# Altium schematic sheet AMS_Master.SchDoc
size A4; DocumentNumber: 0; SheetNumber: 1; SheetTotal: 10
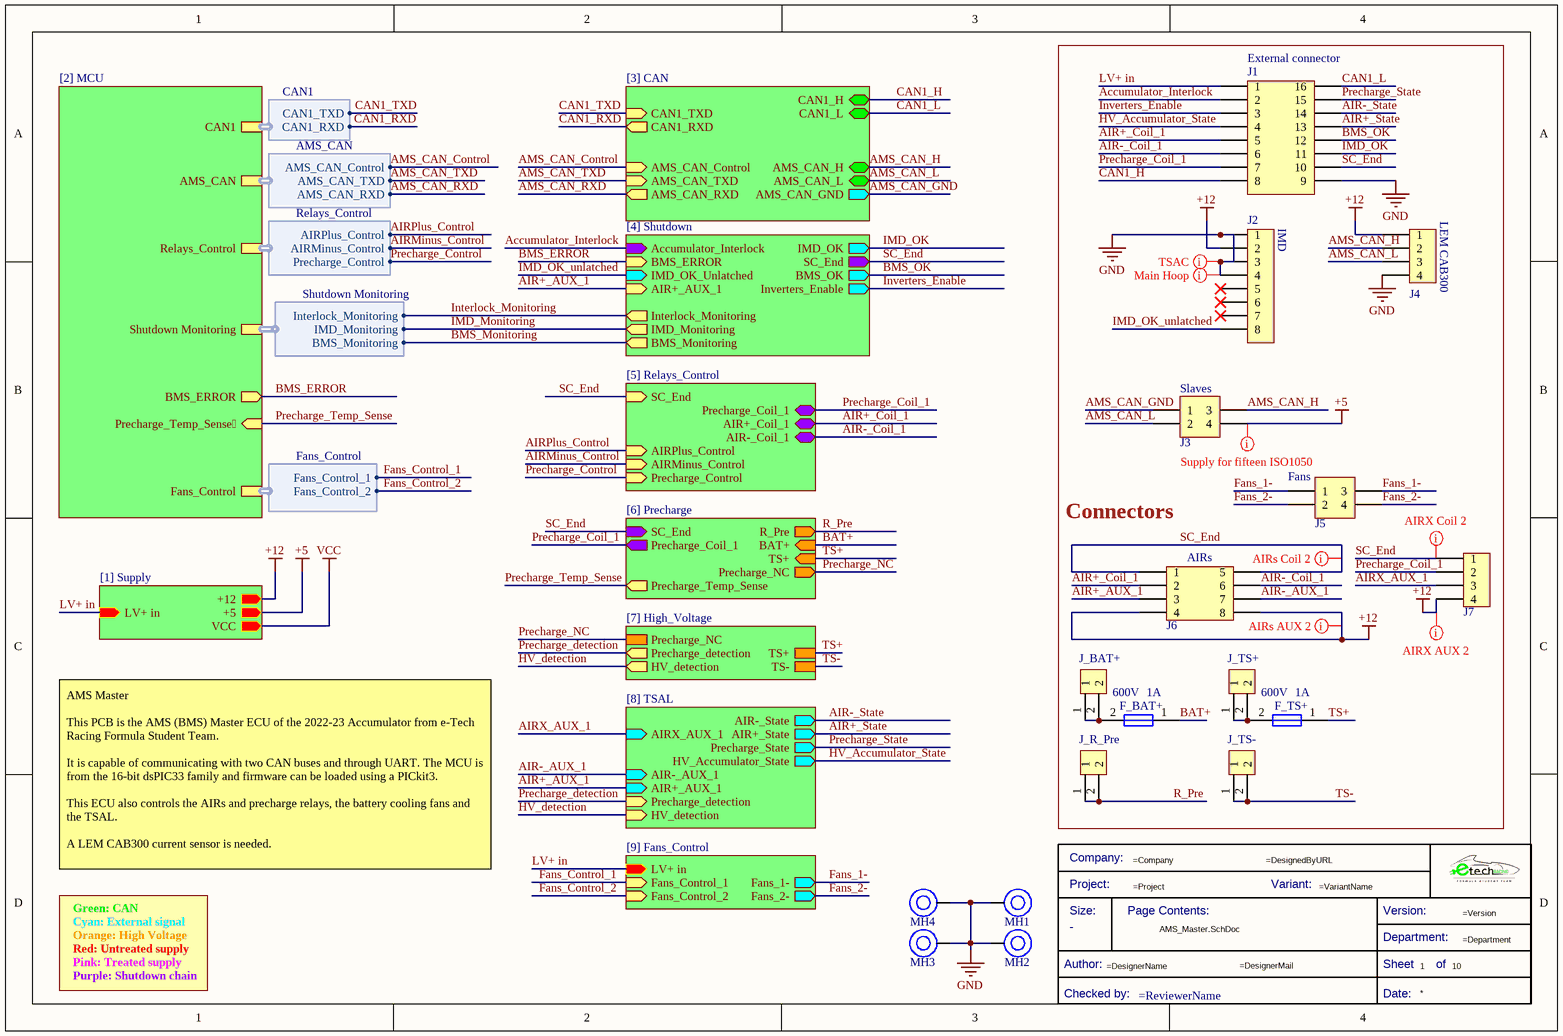
[diagram p0: AMS_Master.SchDoc]

## Parts
*?  Title Block_template  (value not drawn)  (graphical)
F_BAT+  Voltage Rating (DC): 600V  Current Rating: 1A  [Fuse_485001]  (hidden comment: 485001)
F_TS+  Voltage Rating (DC): 600V  Current Rating: 1A  [Fuse_485001]  (hidden comment: 485001)
J1  1053101116  [J_NanoFit_2x8_V]  (value not drawn)
J2  J_MicroFit_1x8_V  [J_MicroFit_1x8_V]  (value not drawn)
J3  430450412  [J_MicroFit_2x2_v]  (value not drawn)
J4  1053092104  [J_NanoFit_1x4_V]  (value not drawn)
J5  J_NanoFit_2x2  [J_NanoFit_2x2_v]  (value not drawn)
J6  0430450800  [J_MicroFit_2x4]  (value not drawn)
J7  436500400  [J_MicroFit_1x4]  (value not drawn)
J_BAT+  436500215  [J_MicroFit_2x1]  (value not drawn)
J_R_Pre  436500215  [J_MicroFit_2x1]  (value not drawn)
J_TS+  436500215  [J_MicroFit_2x1]  (value not drawn)
J_TS-  436500215  [J_MicroFit_2x1]  (value not drawn)
MH1  Mounting_Hole_M4  [Mounting_Hole_M4]  (value not drawn)
MH2  Mounting_Hole_M4  [Mounting_Hole_M4]  (value not drawn)
MH3  Mounting_Hole_M4  [Mounting_Hole_M4]  (value not drawn)
MH4  Mounting_Hole_M4  [Mounting_Hole_M4]  (value not drawn)

## Blocks framed on the sheet
Connectors: F_BAT+ F_TS+ J1-J7 J_BAT+ J_R_Pre J_TS+ J_TS-

## Sub-sheets
CAN = [3] CAN: CAN1_TXD (in), CAN1_RXD (out), AMS_CAN_TXD (in), AMS_CAN_Control (in), AMS_CAN_RXD (out), CAN1_H (bidir), CAN1_L (bidir), AMS_CAN_H (bidir), AMS_CAN_L (bidir), AMS_CAN_GND (out)
Fans_Control = [9] Fans_Control: Fans_Control_1 (in), Fans_Control_2 (in), Fans_1- (out), Fans_2- (out), LV+ in (in)
High_Voltage = [7] High_Voltage: HV_detection (out), Precharge_detection (out), TS-, TS+, Precharge_NC
MCU = [2] MCU: AMS_CAN (harness AMS_CAN), Relays_Control (harness Relays_Control), CAN1 (harness CAN1), BMS_ERROR (out), Fans_Control (harness Fans_Control), Precharge_Temp_Sense (in), Shutdown Monitoring (harness Shutdown Monitoring)
Precharge = [6] Precharge: Precharge_Temp_Sense (out), BAT+ (in), Precharge_NC (out), TS+ (in), SC_End (in), R_Pre (out), Precharge_Coil_1 (out)
Relays_Control = [5] Relays_Control: Precharge_Coil_1 (bidir), AIR+_Coil_1 (bidir), AIR-_Coil_1 (bidir), AIRPlus_Control (in), AIRMinus_Control (in), Precharge_Control (in), SC_End (in)
Shutdown = [4] Shutdown: BMS_ERROR (in), Accumulator_Interlock (in), SC_End (out), Inverters_Enable (out), BMS_OK (out), IMD_OK (out), IMD_OK_Unlatched (in), AIR+_AUX_1 (in), Interlock_Monitoring (out), BMS_Monitoring (out), IMD_Monitoring (out)
Supply = [1] Supply: +5 (out), +12 (out), VCC (out), LV+ in (in)
TSAL = [8] TSAL: Precharge_State (out), AIR-_State (out), AIR+_State (out), HV_Accumulator_State (out), HV_detection (in), AIR-_AUX_1 (in), AIR+_AUX_1 (in), Precharge_detection (in), AIRX_AUX_1 (in)

## Harnesses
Relays_Control: AIRPlus_Control, AIRMinus_Control, Precharge_Control
AMS_CAN: AMS_CAN_Control, AMS_CAN_TXD, AMS_CAN_RXD
CAN1: CAN1_TXD, CAN1_RXD
Fans_Control: Fans_Control_1, Fans_Control_2
Shutdown Monitoring: Interlock_Monitoring, IMD_Monitoring, BMS_Monitoring

## Nets
+5: J3.4 ; sheet Supply/+5
+12: J2.2 J4.1 J6.4 J6.8 J7.4 ; sheet Supply/+12
GND: J1.9 J2.1 J2.3 J2.4 J4.4 MH1.1 MH2.1 MH3.1 MH4.1
VCC: sheet Supply/VCC
Accumulator_Interlock: J1.2 ; sheet Shutdown/Accumulator_Interlock
AIR+_AUX_1: J6.3 ; sheet Shutdown/AIR+_AUX_1, sheet TSAL/AIR+_AUX_1
AIR+_Coil_1: J1.5 J6.2 ; sheet Relays_Control/AIR+_Coil_1
AIR+_State: J1.13 ; sheet TSAL/AIR+_State
AIR-_AUX_1: J6.7 ; sheet TSAL/AIR-_AUX_1
AIR-_Coil_1: J1.6 J6.6 ; sheet Relays_Control/AIR-_Coil_1
AIR-_State: J1.14 ; sheet TSAL/AIR-_State
AIRMinus_Control: sheet Relays_Control/AIRMinus_Control, sheet MCU/Relays_Control.AIRMinus_Control
AIRPlus_Control: sheet Relays_Control/AIRPlus_Control, sheet MCU/Relays_Control.AIRPlus_Control
AIRX_AUX_1: J7.3 ; sheet TSAL/AIRX_AUX_1
AMS_CAN_Control: sheet CAN/AMS_CAN_Control, sheet MCU/AMS_CAN.AMS_CAN_Control
AMS_CAN_GND: J3.1 ; sheet CAN/AMS_CAN_GND
AMS_CAN_H: J3.3 J4.2 ; sheet CAN/AMS_CAN_H
AMS_CAN_L: J3.2 J4.3 ; sheet CAN/AMS_CAN_L
AMS_CAN_RXD: sheet CAN/AMS_CAN_RXD, sheet MCU/AMS_CAN.AMS_CAN_RXD
AMS_CAN_TXD: sheet CAN/AMS_CAN_TXD, sheet MCU/AMS_CAN.AMS_CAN_TXD
BAT+: F_BAT+.1 ; sheet Precharge/BAT+
BMS_ERROR: sheet Shutdown/BMS_ERROR, sheet MCU/BMS_ERROR
BMS_Monitoring: sheet Shutdown/BMS_Monitoring, sheet MCU/Shutdown Monitoring.BMS_Monitoring
BMS_OK: J1.12 ; sheet Shutdown/BMS_OK
CAN1_H: J1.8 ; sheet CAN/CAN1_H
CAN1_L: J1.16 ; sheet CAN/CAN1_L
CAN1_RXD: sheet CAN/CAN1_RXD, sheet MCU/CAN1.CAN1_RXD
CAN1_TXD: sheet CAN/CAN1_TXD, sheet MCU/CAN1.CAN1_TXD
Fans_1-: J5.1 J5.3 ; sheet Fans_Control/Fans_1-
Fans_2-: J5.2 J5.4 ; sheet Fans_Control/Fans_2-
Fans_Control_1: sheet Fans_Control/Fans_Control_1, sheet MCU/Fans_Control.Fans_Control_1
Fans_Control_2: sheet Fans_Control/Fans_Control_2, sheet MCU/Fans_Control.Fans_Control_2
HV_Accumulator_State: J1.4 ; sheet TSAL/HV_Accumulator_State
HV_detection: sheet High_Voltage/HV_detection, sheet TSAL/HV_detection
IMD_Monitoring: sheet Shutdown/IMD_Monitoring, sheet MCU/Shutdown Monitoring.IMD_Monitoring
IMD_OK: J1.11 ; sheet Shutdown/IMD_OK
IMD_OK_unlatched: J2.8 ; sheet Shutdown/IMD_OK_Unlatched
Interlock_Monitoring: sheet Shutdown/Interlock_Monitoring, sheet MCU/Shutdown Monitoring.Interlock_Monitoring
Inverters_Enable: J1.3 ; sheet Shutdown/Inverters_Enable
LV+ in: J1.1 ; sheet Supply/LV+ in, sheet Fans_Control/LV+ in
Precharge_Coil_1: J1.7 J7.2 ; sheet Precharge/Precharge_Coil_1, sheet Relays_Control/Precharge_Coil_1
Precharge_Control: sheet Relays_Control/Precharge_Control, sheet MCU/Relays_Control.Precharge_Control
Precharge_detection: sheet High_Voltage/Precharge_detection, sheet TSAL/Precharge_detection
Precharge_NC: sheet High_Voltage/Precharge_NC, sheet Precharge/Precharge_NC
Precharge_State: J1.15 ; sheet TSAL/Precharge_State
Precharge_Temp_Sense: sheet MCU/Precharge_Temp_Sense, sheet Precharge/Precharge_Temp_Sense
R_Pre: J_R_Pre.1 J_R_Pre.2 ; sheet Precharge/R_Pre
SC_End: J1.10 J6.1 J6.5 J7.1 ; sheet Shutdown/SC_End, sheet Precharge/SC_End, sheet Relays_Control/SC_End
TS+: F_TS+.1 ; sheet High_Voltage/TS+, sheet Precharge/TS+
TS-: J_TS-.1 J_TS-.2 ; sheet High_Voltage/TS-
NetF_BAT+_2: F_BAT+.2 J_BAT+.1 J_BAT+.2
NetF_TS+_2: F_TS+.2 J_TS+.1 J_TS+.2

Not connected (* = marked no-connect by the designer): J2 5* 6* 7*

## Layout directives
mark named AIRs Coil 2: SC_End
mark named AIRs AUX 2: +12
mark named Supply for fifteen ISO1050: +5
mark named TSAC: GND
mark named Main Hoop: GND
mark named AIRX Coil 2: SC_End
mark named AIRX AUX 2: +12

## Notes on the sheet
- (near J1) External connector
- (near J2) IMD
- (near J4) LEM CAB300
- (near J3) Slaves
- (near J5) Fans
- (near J6) AIRs
- AMS Master
  This PCB is the AMS (BMS) Master ECU of the 2022-23 Accumulator from e-Tech Racing Formula Student Team.
  It is capable of communicating with two CAN buses and through UART. The MCU is from the 16-bit dsPIC33 family and firmware can be loaded using a PICkit3.
  This ECU also controls the AIRs and precharge relays, the battery cooling fans and the TSAL.
  A LEM CAB300 current sensor is needed.
- Cyan: External signal
- Green: CAN
- Orange: High Voltage
- Red: Untreated supply
- Purple: Shutdown chain
- Pink: Treated supply
- Title
- Size:
- Date:
- A4
- Number:
- Time:
- Revision:
- Sheet
- of
- File:
- (in symbol Title Block_template) Company:; Project:; Variant:; Size:; Page Contents:; Version:; Department:; Author:; Sheet; of; Checked by:; Date:

## Library data of the parts
*? = Title Block_template: Standard Title Block; Category: Title Block; Checked by:: =ReviewerName; Size: -
F_BAT+ F_TS+ = Fuse_1A_600V: Surface Mount Fuses 600V 1A Fast Acting; Manufacturer 1: Littelfuse; Manufacturer Part Number 1: 0485001.DR; Body Material: Ceramic; Voltage Rating (AC): 250V; Resistance: 264mR; DC Cold Resistance: 304.4mR; Fuse Type: Board Mount (Cartridge Style Excluded); Approvals: UL,CSA; .Creator: DO; Supplier 1: Arrow Electronics; RoHS: Yes; Category: Fuses; Stock 1: 4123; Pricing 1: 1=2,82900, 5=2,81400, 10=2,75200, 50=2,59800, 100=2,40300, 250=2,37900, 500=2,30400, 1500=2,24900, 3000=2,11600 (USD); Mount: Surface Mount; Case/Package: SMD/SMT; Housing Material: Ceramic; Min Operating Temperature: -55°C; Max Operating Temperature: 125°C; Packaging: Tape and Reel; Package Quantity: 1; Series: 485; Termination: SMD/SMT; Fuse Current: 1A; Length: 12.1mm; Width: 0.177inch; Height: 0.177inch; Depth: 4.5mm; REACH SVHC: No SVHC; Lead Free: Lead Free; RoHS Compliant: Yes; ComponentLink1URL: http://www.farnell.com/datasheets/1945989.pdf?src-supplier=Farnell; ComponentLink1Description: http://www.farnell.com/datasheets/1945989.pdf?src-supplier=Farnell; ComponentLink2URL: http://www.farnell.com/datasheets/2282568.pdf?src-supplier=Farnell; ComponentLink2Description: http://www.farnell.com/datasheets/2282568.pdf?src-supplier=Farnell; ComponentLink3URL: http://www.mouser.com/ds/2/240/Littelfuse485_datasheet_080512-201879.pdf?src-supplier=Mouser; ComponentLink3Description: http://www.mouser.com/ds/2/240/Littelfuse485_datasheet_080512-201879.pdf?src-supplier=Mouser; ComponentLink4URL: http://components.arrow.com/part/dataview/56707787S790276N3675?src-supplier=Arrow+Electronics; ComponentLink4Description: http://components.arrow.com/part/dataview/56707787S790276N3675?src-supplier=Arrow+Electronics; ComponentLink5URL: http://www.littelfuse.com/~/media/Files/Littelfuse/Technical%20Resources/Documents/Data%20Sheets/Littelfuse_Fuse_485_Datasheet.pdf?src-supplier=Element14; ComponentLink5Description: http://www.littelfuse.com/~/media/Files/Littelfuse/Technical%20Resources/Documents/Data%20Sheets/Littelfuse_Fuse_485_Datasheet.pdf?src-supplier=Element14; ComponentLink6URL: http://www.littelfuse.com/~/media/electronics/datasheets/fuses/littelfuse_fuse_485_datasheet.pdf.pdf?src-supplier=Digi-Key; ComponentLink6Description: http://www.littelfuse.com/~/media/electronics/datasheets/fuses/littelfuse_fuse_485_datasheet.pdf.pdf?src-supplier=Digi-Key; Supplier Part Number 1: 0485001.DR; Voltage Rating: 600V
J1 = J_NanoFit_2x8_V: Nano-Fit Vertical Header Through Hole 2.50mm Pitch Dual Row 16 Circuits with Kinked Pins Tin (Sn) Plating Black; Manufacturer 1: Molex; Manufacturer Part Number 1: 105310-1116; Connector Type: Header,Male Pin; Number of Positions: 16; .Creator: AC; Supplier 1: Digi-Key; RoHS: No; Category: Headers and Wire Housings; Stock 1: 84; Pricing 1: 1=3,21000, 10=2,82400, 84=2,24619, 1008=1,86110, 4956=1,66858 (USD); Mount: Through Hole; Contact Plating: Tin; Contact Material: Brass; Contact Shape: Square; Insulation Material: Polymer; Insulation Color: Black; Min Operating Temperature: -40°C; Max Operating Temperature: 105°C; Fastening Type: Latch; Packaging: Tray; Number of Rows: 2; Termination: Kinked Pin; ComponentLink1URL: https://www.molex.com/pdm_docs/sd/1053101210_sd.pdf?src-supplier=Digi-Key; ComponentLink1Description: https://www.molex.com/pdm_docs/sd/1053101210_sd.pdf?src-supplier=Digi-Key; Supplier Part Number 1: WM16885-ND; ComponentLink2Description: Molex; ComponentLink2URL: https://www.molex.com/molex/products/part-detail/pcb_headers/1053101116
J2 = J_MicroFit_1x8_V: Conn Wire to Board HDR 8 POS 3mm Solder ST Top Entry Thru-Hole Micro-Fit 3.0™ Tray; Manufacturer 1: Molex; Manufacturer Part Number 1: 43650-1200; .Creator: DR; Supplier 1: Newark; RoHS: Yes; Category: Headers and Wire Housings; Stock 1: 13; Pricing 1: 1=3,36000, 10=2,96000, 25=2,76000, 50=2,56000, 100=2,36000, 250=2,08000 (USD); Supplier Part Number 1: 01AH1239; Supplier 2: Arrow Electronics; Manufacturer 2: Molex; Manufacturer Part Number 2: 43650-0815; Stock 2: 2244; Pricing 2: 1=1,89510, 10=1,68890, 80=1,45980, 1122=1,20850, 5610=1,08880 (USD); Supplier Part Number 2: 43650-0815; ComponentLink1URL: https://datasheet.ciiva.com/16085/281240436500815-pcb-headers-16085998.pdf?src-supplier=Onlinecomponents.com; ComponentLink1Description: https://datasheet.ciiva.com/16085/281240436500815-pcb-headers-16085998.pdf?src-supplier=Onlinecomponents.com; ComponentLink2URL: https://datasheet.ciiva.com/5151/0436500815-pcb-headers-148729-5151340.pdf?src-supplier=Mouser; ComponentLink2Description: https://datasheet.ciiva.com/5151/0436500815-pcb-headers-148729-5151340.pdf?src-supplier=Mouser; ComponentLink3URL: https://datasheet.ciiva.com/26916/getdatasheetpartid-78997-26916336.pdf?src-supplier=Verical; ComponentLink3Description: https://datasheet.ciiva.com/26916/getdatasheetpartid-78997-26916336.pdf?src-supplier=Verical; ComponentLink4URL: https://datasheet.ciiva.com/30117/57400436500815-pcb-headers-30117736.pdf?src-supplier=Onlinecomponents.com; ComponentLink4Description: https://datasheet.ciiva.com/30117/57400436500815-pcb-headers-30117736.pdf?src-supplier=Onlinecomponents.com
J3 = J_MicroFit_2x2: Header 2 Row Vertical Polarizing Peg 4 Pin Tin Plate SMT/Glow Wire Kinked Leads; Manufacturer 1: Molex; Manufacturer Part Number 1: 43045-0412; .Creator: DR; Supplier 1: Arrow Electronics; RoHS: Yes; Category: Headers and Wire Housings; Stock 1: 54122; Pricing 1: 1=1,24720, 10=1,02970, 80=0,85390, 2232=0,63810, 6696=0,59030, 11160=0,55550 (USD); ComponentLink1URL: https://datasheet.ciiva.com/19462/883368-19462265.pdf?src-supplier=Jameco; ComponentLink1Description: https://datasheet.ciiva.com/19462/883368-19462265.pdf?src-supplier=Jameco; ComponentLink2URL: https://datasheet.ciiva.com/5158/0430450412-pcb-headers-142874-5158187.pdf?src-supplier=Mouser; ComponentLink2Description: https://datasheet.ciiva.com/5158/0430450412-pcb-headers-142874-5158187.pdf?src-supplier=Mouser; ComponentLink3URL: https://datasheet.ciiva.com/30095/176640430450412-pcb-headers-30095929.pdf?src-supplier=Onlinecomponents.com; ComponentLink3Description: https://datasheet.ciiva.com/30095/176640430450412-pcb-headers-30095929.pdf?src-supplier=Onlinecomponents.com; ComponentLink4URL: https://datasheet.ciiva.com/11747/0900766b800bd7d2-11747137.pdf?src-supplier=RSComponents; ComponentLink4Description: https://datasheet.ciiva.com/11747/0900766b800bd7d2-11747137.pdf?src-supplier=RSComponents; ComponentLink5URL: https://datasheet.ciiva.com/26916/getdatasheetpartid-253008-26916516.pdf?src-supplier=Verical; ComponentLink5Description: https://datasheet.ciiva.com/26916/getdatasheetpartid-253008-26916516.pdf?src-supplier=Verical; ComponentLink6URL: https://datasheet.ciiva.com/22637/1928349-22637530.pdf?src-supplier=Element14; ComponentLink6Description: https://datasheet.ciiva.com/22637/1928349-22637530.pdf?src-supplier=Element14; ComponentLink7URL: https://datasheet.ciiva.com/9468/0430450412-pcb-headers-9468485.pdf?src-supplier=Avnet; ComponentLink7Description: https://datasheet.ciiva.com/9468/0430450412-pcb-headers-9468485.pdf?src-supplier=Avnet; Supplier Part Number 1: 43045-0412
J4 = J_NanoFit_1x4_V_W: Conn HDR 4 POS 2.5mm Solder ST Thru-Hole 4 Terminal 1 Port Nano-Fit Tray; Manufacturer 1: Molex; Manufacturer Part Number 1: 105309-2104; .Creator: DR; Supplier 1: Newark; RoHS: No; Category: Headers and Wire Housings; Stock 1: 1183; Pricing 1: 1=1,30000, 10=1,15000, 25=1,11000, 50=1,07000, 100=1,02000, 250=0,94400 (USD); Supplier Part Number 1: 44AJ4572
J5 = J_NanoFit_2x2: Conn Nano-Fit Power HDR 4 POS 2.5mm Solder ST Through Hole 4 Terminal Single Port Tray; Manufacturer 1: Molex; Manufacturer Part Number 1: 1053101104; Supplier 1: Farnell; RoHS: Yes; Category: Uncategorized; Stock 1: 255; Pricing 1: 1=1,43000, 10=1,18000, 50=0,74900, 100=0,72900, 500=0,71400, 1000=0,70700 (EUR); ComponentLink1URL: https://www.molex.com/pdm_docs/ps/PS-105300-100-001.pdf?src-supplier=Digi-Key; ComponentLink1Description: https://www.molex.com/pdm_docs/ps/PS-105300-100-001.pdf?src-supplier=Digi-Key; Supplier Part Number 1: 2820681
J6 = J_MicroFit_2x4: Connector Wire to Board Header 8 Position 3mm Solder Right Angle Thru-Hole Tray; Manufacturer 1: Molex; .Creator: GP; Supplier 1: Arrow Electronics; Manufacturer Part Number 1: 0430450800; RoHS: Yes; Category: Headers and Wire Housings; Stock 1: 47494; Pricing 1: 1=2,57150, 10=2,34190, 25=2,14460, 50=2,00330, 100=1,89490, 500=1,75400 (USD); Supplier Part Number 1: 43045-0800
J7 = J_MicroFit_1x4: Connector Wire to Board Header 4 Position 3mm Solder Right Angle Thru-Hole Tray; Manufacturer 1: Molex; Manufacturer Part Number 1: 43650-0400; Current Rating: 5A; Voltage Rating: 600V; Contact Resistance: 10mR; Connector Type: Plug; Number of Positions: 4; Gender: Male; Voltage Rating (DC): 250V; Glow Wire Compliant: Compliant; Supplier 1: Farnell; RoHS: Yes; Category: Headers and Wire Housings; Stock 1: 4623; Pricing 1: 1=1,24000, 10=1,22000, 50=1,19000, 100=1,17000, 500=1,14000, 1000=1,12000 (EUR); Mount: Through Hole,Cable; Contact Material: Brass,Copper Alloy; Contact Plating: Tin; Color: Black; Housing Color: Black; Housing Material: Thermoplastic; Min Operating Temperature: -40°C; Max Operating Temperature: 105°C; Termination: Solder; Orientation: Right Angle; Number of Rows: 1; Packaging: Tray; Package Quantity: 2380; Number of Contacts: 4; Max Voltage Rating (AC): 600V; Number of Circuits: 4; Series: 43650; Length: 14.86mm; Height: 4.5mm; Pitch: 3mm; Depth: 3.6mm; Radiation Hardening: No; Halogen Free: Low Halogen; Lead Free: Contains Lead; Flammability Rating: UL94 V-0; RoHS Compliant: Yes; ComponentLink1URL: https://datasheet.ciiva.com/19462/884184-19462234.pdf?src-supplier=Jameco; ComponentLink1Description: https://datasheet.ciiva.com/19462/884184-19462234.pdf?src-supplier=Jameco; ComponentLink2URL: https://datasheet.ciiva.com/5151/0436500400-pcb-headers-148663-5151881.pdf?src-supplier=Mouser; ComponentLink2Description: https://datasheet.ciiva.com/5151/0436500400-pcb-headers-148663-5151881.pdf?src-supplier=Mouser; ComponentLink3URL: https://datasheet.ciiva.com/16085/0436500400-pcb-headers-16085752.pdf?src-supplier=Onlinecomponents.com; ComponentLink3Description: https://datasheet.ciiva.com/16085/0436500400-pcb-headers-16085752.pdf?src-supplier=Onlinecomponents.com; ComponentLink4URL: https://datasheet.ciiva.com/11748/0900766b80d6135b-11748178.pdf?src-supplier=RSComponents; ComponentLink4Description: https://datasheet.ciiva.com/11748/0900766b80d6135b-11748178.pdf?src-supplier=RSComponents; ComponentLink5URL: https://datasheet.ciiva.com/30221/142510436500400-pcb-headers-30221164.pdf?src-supplier=Onlinecomponents.com; ComponentLink5Description: https://datasheet.ciiva.com/30221/142510436500400-pcb-headers-30221164.pdf?src-supplier=Onlinecomponents.com; ComponentLink6URL: https://datasheet.ciiva.com/17080/70266896-17080471.pdf?src-supplier=Allied+Electronics; ComponentLink6Description: https://datasheet.ciiva.com/17080/70266896-17080471.pdf?src-supplier=Allied+Electronics; ComponentLink7URL: https://datasheet.ciiva.com/7094/1946229-7094763.pdf?src-supplier=Newark; ComponentLink7Description: https://datasheet.ciiva.com/7094/1946229-7094763.pdf?src-supplier=Newark; ComponentLink8URL: https://datasheet.ciiva.com/9449/0436500400-pcb-headers-9449446.pdf?src-supplier=Avnet; ComponentLink8Description: https://datasheet.ciiva.com/9449/0436500400-pcb-headers-9449446.pdf?src-supplier=Avnet; Supplier Part Number 1: 1012232
J_BAT+ J_R_Pre J_TS+ J_TS- = J_MicroFit_2x1: Header 1 Row Vertical Polarizing Peg 2 Pin SMT/Glow Wire Compatible Tin Plate; Manufacturer 1: Molex; Manufacturer Part Number 1: 43650-0215; Supplier 1: Arrow Electronics; RoHS: Yes; Category: Headers and Wire Housings; Stock 1: 11086; Pricing 1: 1=0,87800, 10=0,74400, 80=0,63070, 3264=0,47000, 6528=0,45100, 13056=0,41760 (USD); ComponentLink1URL: https://datasheet.ciiva.com/19462/884109-19462034.pdf?src-supplier=Jameco; ComponentLink1Description: https://datasheet.ciiva.com/19462/884109-19462034.pdf?src-supplier=Jameco; ComponentLink2URL: https://datasheet.ciiva.com/5157/0436500215-pcb-headers-148687-5157608.pdf?src-supplier=Mouser; ComponentLink2Description: https://datasheet.ciiva.com/5157/0436500215-pcb-headers-148687-5157608.pdf?src-supplier=Mouser; ComponentLink3URL: https://datasheet.ciiva.com/16085/0436500215-pcb-headers-16085668.pdf?src-supplier=Onlinecomponents.com; ComponentLink3Description: https://datasheet.ciiva.com/16085/0436500215-pcb-headers-16085668.pdf?src-supplier=Onlinecomponents.com; ComponentLink4URL: https://datasheet.ciiva.com/11748/0900766b80307ce2-11748388.pdf?src-supplier=RSComponents; ComponentLink4Description: https://datasheet.ciiva.com/11748/0900766b80307ce2-11748388.pdf?src-supplier=RSComponents; ComponentLink5URL: https://datasheet.ciiva.com/9432/0436500215-pcb-headers-9432850.pdf?src-supplier=Avnet; ComponentLink5Description: https://datasheet.ciiva.com/9432/0436500215-pcb-headers-9432850.pdf?src-supplier=Avnet; ComponentLink6URL: https://datasheet.ciiva.com/7920/1889390-7920892.pdf?src-supplier=Element14; ComponentLink6Description: https://datasheet.ciiva.com/7920/1889390-7920892.pdf?src-supplier=Element14; Supplier Part Number 1: 43650-0215